# Altium project TC_TP2_EJ6.PrjPcb
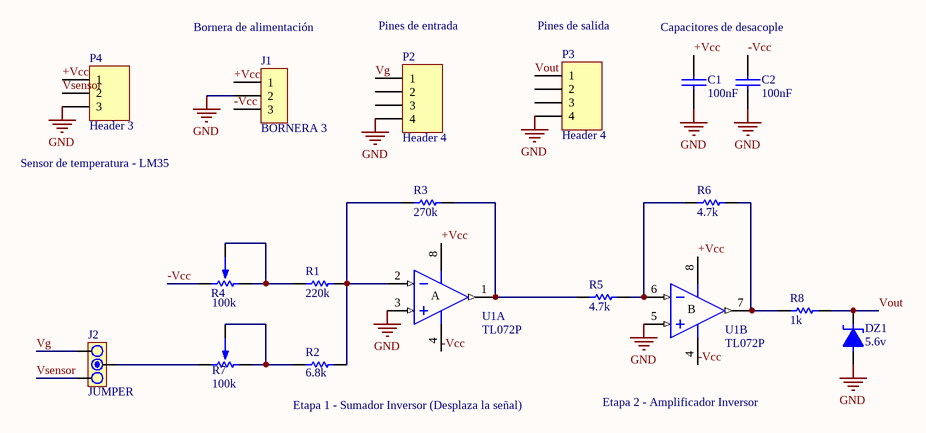
[diagram p0: TC_TP2_EJ6.SchDoc]
1 sheet, 17 parts. Net scope: global (net labels, ports and power ports of the same name join across sheets).
Board file: TC_TP2_EJ6.PcbDoc

## Sheet TC_TP2_EJ6.SchDoc
size A4

### Parts
C1  100nF  [CAP200]
C2  100nF  [CAP200]
DZ1  5.6v  [DO41]
J1  BORNERA 3  [BORNERA3]
J2  JUMPER  [JUMPER3]
P2  Header 4  [HDR1X4]
P3  Header 4  [HDR1X4]
P4  Header 3  [HDR1X3]
R1  220k  [RES400]
R2  6.8k  [RES400]
R3  270k  [RES400]
R4  100k  [PRESET V]
R5  4.7k  [RES400]
R6  4.7k  [RES400]
R7  100k  [PRESET V]
R8  1k  [RES400]
U1  TL072P  [P008]  (parts A,B of 2)

### Nets
GND: C1.2 C2.2 DZ1.1 J1.2 P2.4 P3.4 P4.3 U1.3(IN+) U1.5(IN+)
+Vcc: C1.1 J1.1 P4.1 U1.8(V+)
-Vcc: C2.1 J1.3 R4.1 U1.4(V-)
Vg: J2.3 P2.1
Vout: DZ1.2 P3.1 R8.2
Vsensor: J2.1 P4.2
NetJ2_2: J2.2 R7.1
NetR1_1: R1.1 R4.2 R4.3
NetR1_2: R1.2 R2.2 R3.1 U1.2(IN-)
NetR2_1: R2.1 R7.2 R7.3
NetR3_2: R3.2 R5.1 U1.1(OUT)
NetR5_2: R5.2 R6.1 U1.6(IN-)
NetR6_2: R6.2 R8.1 U1.7(OUT)

Not connected (* = marked no-connect by the designer): P2 2 3; P3 2 3

### Notes on the sheet
- (near J1) Bornera de alimentación
- (near P2) Pines de entrada
- (near P3) Pines de salida
- Capacitores de desacople
- (near P4) Sensor de temperatura - LM35
- (near R2) Etapa 1 - Sumador Inversor (Desplaza la señal)
- Etapa 2 - Amplificador Inversor
- (in symbol TL072P, part A) A
- (in symbol TL072P, part B) B

### Library data of the parts
C1 C2 = CAP
DZ1 = DIODO ZENER
J2 = JUMPER3
P2 P3 = Header 4: Header, 4-Pin; LatestRevisionDate: 17-Jul-2002; LatestRevisionNote: Re-released for DXP Platform.; Publisher: Altium Limited
P4 = Header 3: Header, 3-Pin; LatestRevisionDate: 17-Jul-2002; LatestRevisionNote: Re-released for DXP Platform.; Publisher: Altium Limited
R1-R3 R5 R6 R8 = RES
R4 R7 = PRESET
U1 = TL072P: Low-Noise JFET-Input Operational Amplifier; Published: 16-Jan-2001; LatestRevisionDate: 04-Mar-2005; LatestRevisionNote: Stylized 3D Model Added.; DatasheetVersion: Aug-1996; PackageVersion: Jun-1999; PackageReference: P008; Publisher: Altium Limited; PackageDescription: DIP; 8 Leads; Row Spacing 7.62 mm; Pitch 2.54 mm; Code_JEDEC: MO-001-AN; ComponentLink1Description: Manufacturer Link; ComponentLink1URL: http://www.ti.com/; ComponentLink2Description: Datasheet; ComponentLink2URL: http://www-s.ti.com/sc/ds/tl072.pdf